# EAGLE design powersupppy (EAGLE 7.2.0)
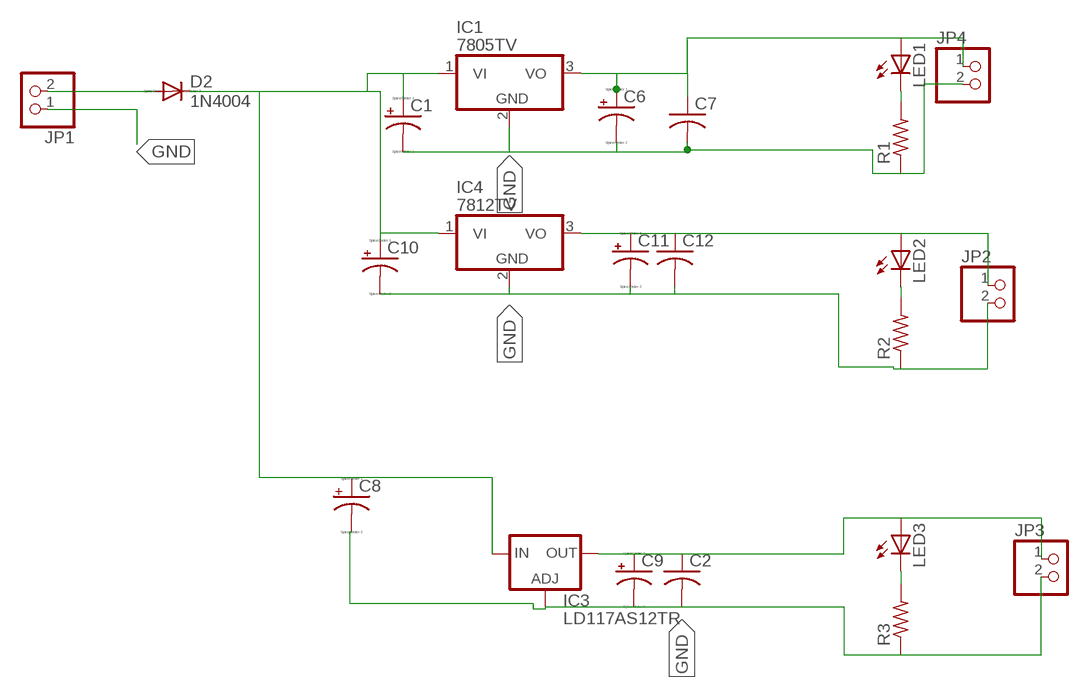
[diagram p0: schematic, sheet 1]

## Parts
C1  CPOL-USE2.5-5  [E2,5-5]
C2  C-US050-025X075  [C050-025X075]
C6  CPOL-USE2.5-5  [E2,5-5]
C7  C-US050-025X075  [C050-025X075]
C8  CPOL-USE2.5-5  [E2,5-5]
C9  CPOL-USE2.5-5  [E2,5-5]
C10  CPOL-USE2.5-5  [E2,5-5]
C11  CPOL-USE2.5-5  [E2,5-5]
C12  C-US050-025X075  [C050-025X075]
D2  1N4004  [DO41-10]
IC1  7805TV  [TO220V]
IC3  LD117AS12TR  [SOT223]
IC4  7812TV  [TO220V]
JP1  PINHD-1X2  [1X02]
JP2  PINHD-1X2  [1X02]
JP3  PINHD-1X2  [1X02]
JP4  PINHD-1X2  [1X02]
LED1  LED3MM  [LED3MM]
LED2  LED3MM  [LED3MM]
LED3  LED3MM  [LED3MM]
R1  R-US_0207/10  [0207/10]
R2  R-US_0207/10  [0207/10]
R3  R-US_R1206  [R1206]

## Nets
GND: C1.- C2.2 C6.- C7.2 C8.- C9.- C10.- C11.- C12.2 IC1.2(GND) IC3.1(ADJ) IC4.2(GND) JP1.1 JP2.2 JP3.2 JP4.2 R1.1 R2.1 R3.1
N$2: D2.A JP1.2
N$4: C1.+ C8.+ C10.+ D2.C IC1.1(VI) IC3.3(IN) IC4.1(VI)
N$6: C6.+ C7.1 IC1.3(VO) JP4.1 LED1.A
N$7: LED1.K(C) R1.2
N$10: C11.+ C12.1 IC4.3(VO) JP2.1 LED2.A
N$11: LED2.K(C) R2.2
N$13: C2.1 C9.+ IC3.4(OUT) JP3.1 LED3.A
N$14: LED3.K(C) R3.2

## Library data of the parts
C1 C6 C8-C11 = resistor:CPOL-US: POLARIZED CAPACITOR, American symbol
C2 C7 C12 = rcl:C-US: CAPACITOR, American symbol
D2 = diode:1N4004: DIODE general purpose rectifier, 1 A
IC1 IC4 = linear:78*: Positive VOLTAGE REGULATOR Source: http://cache.national.com/ds/LM/LM78L05.pdf http://www.fairchildsemi.com/ds/LM/LM7805.pdf
IC3 = v-reg:LD117A?*: Low drop fixed and adjustable positive voltage regulators 1 A Source: http://www.st.com/stonline/products/literature/ds/7194/ld1117axx.pdf
JP1-JP4 = pinhead:PINHD-1X2: PIN HEADER
LED1-LED3 = led:LED: LED OSRAM: - CHIPLED LG R971, LG N971, LY N971, LG Q971, LY Q971, LO R971, LY R971 LH N974, LH R974 LS Q976, LO Q976, LY Q976 LO Q996 - Hyper CHIPLED LW Q18S LB Q993, LB Q99A, LB R99A - SideLED LS A670, LO A670, LY A670, LG A670, LP A670 LB A673, LV A673, LT A673, LW A673 LH A674 LY A675 LS A676, LA A676, LO A676, LY A676, LW A676 LS A679, LY A679, LG A679 - Hyper Micro SIDELED® LS Y876, LA Y876, LO Y876, LY Y876 LT Y87S - SmartLED LW L88C, LW L88S LB L89C, LB L89S, LG L890 LS L89K, LO L89K, LY L89K LS L896, LA L896, LO L896, LY L896 - TOPLED LS T670, LO T670, LY T670, LG T670, LP T670 LSG T670, LSP T670, LSY T670, LOP T670, LYG T670 LG T671, LOG T671, LSG T671 LB T673, LV T673, LT T673, LW T673 LH T674 LS T676, LA T676, LO T676, LY T676, LB T676, LH T676, LSB T676, LW T676 LB T67C, LV T67C, LT T67C, LS T67K, LO T67K, LY T67K, LW E67C LS E67B, LA E67B, LO E67B, LY E67B, LB E67C, LV E67C, LT E67C LW T67C LS T679, LY T679, LG T679 LS T770, LO T770, LY T770, LG T770, LP T770 LB T773, LV T773, LT T773, LW T773 LH T774 LS E675, LA E675, LY E675, LS T675 LS T776, LA T776, LO T776, LY T776, LB T776 LHGB T686 LT T68C, LB T68C - Hyper Mini TOPLED® LB M676 - Mini TOPLED Santana® LG M470 LS M47K, LO M47K, LY M47K Source: http://www.osram.convergy.de LUXEON: - LUMILED® LXK2-PW12-R00, LXK2-PW12-S00, LXK2-PW14-U00, LXK2-PW14-V00 LXK2-PM12-R00, LXK2-PM12-S00, LXK2-PM14-U00 LXK2-PE12-Q00, LXK2-PE12-R00, LXK2-PE12-S00, LXK2-PE14-T00, LXK2-PE14-U00 LXK2-PB12-K00, LXK2-PB12-L00, LXK2-PB12-M00, LXK2-PB14-N00, LXK2-PB14-P00, LXK2-PB14-Q00 LXK2-PR12-L00, LXK2-PR12-M00, LXK2-PR14-Q00, LXK2-PR14-R00 LXK2-PD12-Q00, LXK2-PD12-R00, LXK2-PD12-S00 LXK2-PH12-R00, LXK2-PH12-S00 LXK2-PL12-P00, LXK2-PL12-Q00, LXK2-PL12-R00 Source: www.luxeon.com KINGBRIGHT: KA-3528ASYC Source: www.kingbright.com
R1-R3 = rcl:R-US_: RESISTOR, American symbol

## Board
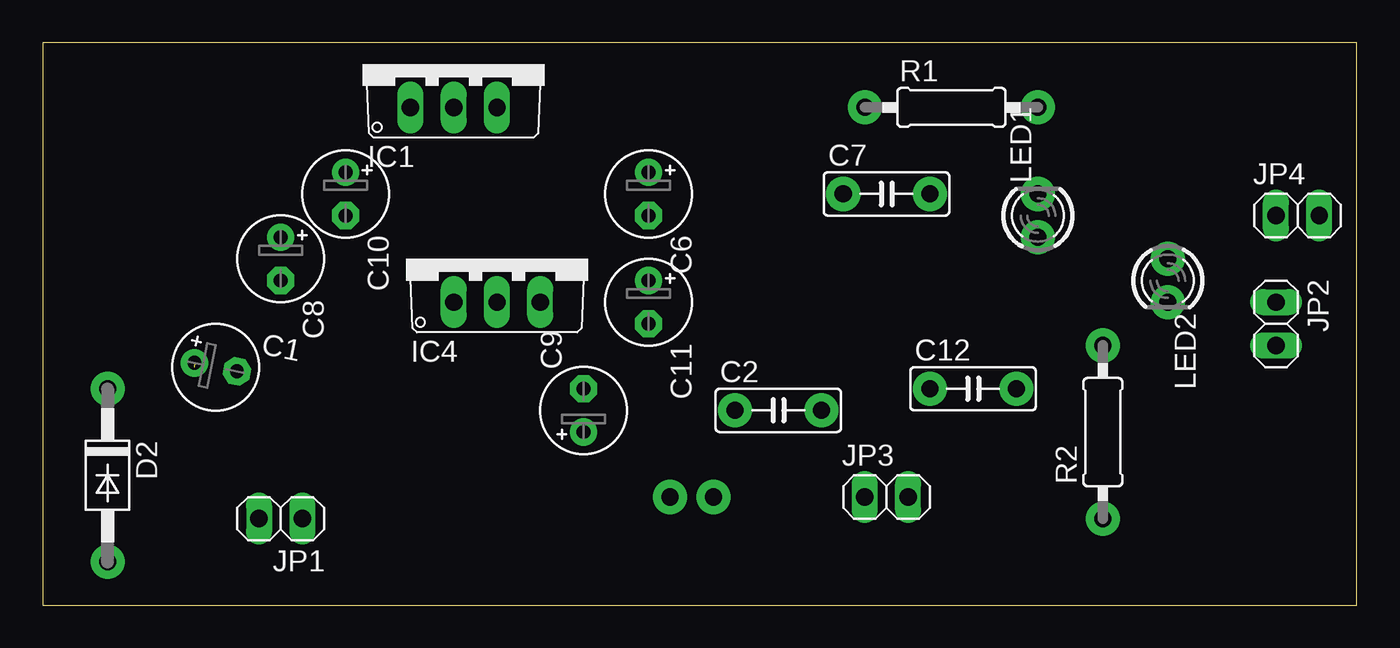
[diagram p1: board, top side]
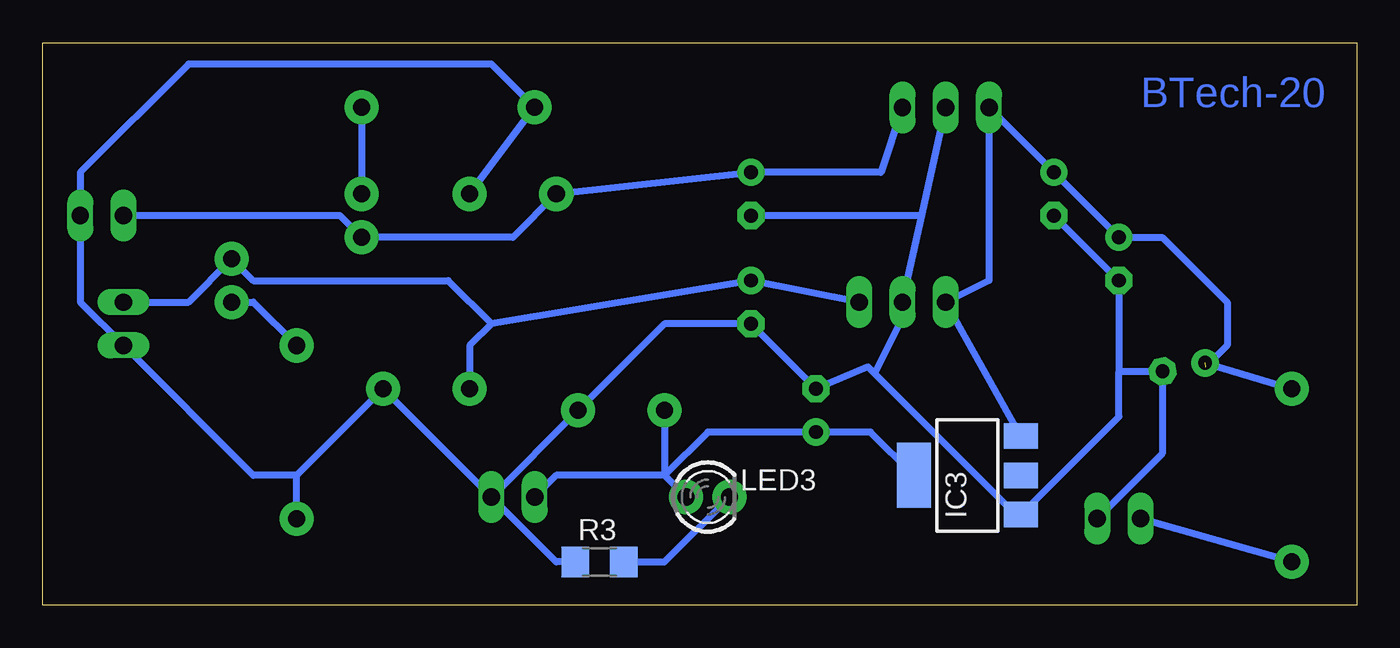
[diagram p2: board, bottom side, seen from below]

Size 77.14 x 33.01 mm. Coordinates in mm from the lower left corner, seen from the top.
Outline: 0,0 77.14,0 77.14,33.01 0,33.01 0,0
Copper layers (1*16): Top 0.035mm / dielectric 1.5mm / Bottom 0.035mm
Design rules "default *": minimum track width 10mil, minimum drill 24mil, track to track 16mil, track to pad 8mil, pad to pad 8mil, via to via 8mil, smd to smd 8mil, copper to edge 40mil, drill to drill 8mil, minimum pad ring 10mil, minimum via ring 8mil, stop-mask expansion 4mil, vias tented up to drill 0mil, thermal gap 10mil

### Footprints (pad centres in the part's own frame; a part is rotated, then mirrored left to right if it is on the bottom)
E2,5-5 = drill 0.813 pad 1.6: + -1.27,0 | drill 0.813 pad 1.6 octagon: - 1.27,0
C050-025X075 = drill 1 pad 2: 1 -2.54,0; 2 2.54,0
DO41-10 = drill 1 pad 2: A 5.08,0; C -5.08,0
TO220V = drill 1.016 long: 1 -2.54,-2.54; 2 0,-2.54; 3 2.54,-2.54
SOT223 = smd 1.5 x 2: 1 -2.3,-3.15; 2 0,-3.15; 3 2.3,-3.15 | smd 3.8 x 2: 4 0,3.15
1X02 = drill 1.016 long: 1 -1.27,0; 2 1.27,0
LED3MM = drill 1 pad 2: A -1.27,0; K 1.27,0
0207/10 = drill 1 pad 2: 1 -5.08,0; 2 5.08,0
R1206 = smd 1.6 x 1.803: 1 -1.422,0; 2 1.422,0

### Placement (x,y rotation side)
C1  10.16,13.97 348.7 top
C2  43.18,11.43 0 top
C6  35.56,24.13 270 top
C7  49.53,24.13 0 top
C8  13.97,20.32 270 top
C9  31.75,11.43 90 top
C10  17.78,24.13 270 top
C11  35.56,17.78 270 top
C12  54.61,12.7 0 top
D2  3.81,7.62 270 top
IC1  24.13,31.75 0 top
IC3  22.86,7.62 90 bottom
IC4  26.67,20.32 0 top
JP1  13.97,5.08 180 top
JP2  72.39,16.51 270 top
JP3  49.53,6.35 0 top
JP4  73.66,22.86 0 top
LED1  58.42,22.86 90 top
LED2  66.04,19.05 270 top
LED3  38.1,6.35 0 bottom
R1  53.34,29.21 0 top
R2  62.23,10.16 90 top
R3  44.45,2.54 0 bottom

### Tracks (layer width: path | path; a pad name or v marks a point on that pad's centre or on a via)
GND
  Bottom 0.406: R3.1 46.99,2.54 JP3.2 | R2.1 62.23,7.62 | 62.23,7.62 C12.2 JP3.2 | 62.23,7.62 64.77,7.62 JP2.2 74.93,17.78 JP4.2 74.93,25.4 68.58,31.75 50.8,31.75 R1.1 C7.2 | JP3.2 C2.2 40.64,16.51 C11.- C9.- 28.68,13.98 28.31,13.6 | C10.- C8.- 13.97,13.7 | 13.97,13.7 13.97,11.06 IC3.1 20.02,5.32 28.31,13.6 | 25.53,22.89 IC4.2 26.67,16.88 28.31,13.6 | 25.53,22.89 IC1.2 | C6.- 35.53,22.89 25.53,22.89 | 11.43,13.7 11.43,8.89 JP1.1 | C1.- 11.43,13.7 | 11.43,13.7 13.97,13.7
N$2
  Bottom 0.406: D2.A JP1.2
N$4  (1 unrouted)
  Bottom 0.406: C1.+ D2.C | IC3.3 IC4.1 21.59,19.05 IC1.1 C10.+ C8.+ 11.43,21.59 7.62,17.78 7.62,15.24 8.89,13.97
N$6
  Bottom 0.406: IC1.3 27.94,25.4 C6.+ C7.1 49.53,21.59 LED1.A 59.69,22.86 JP4.1
N$7
  Bottom 0.406: R1.2 LED1.K
N$10
  Bottom 0.406: JP2.1 68.58,17.78 LED2.A 64.77,19.05 53.34,19.05 50.8,16.51 | 50.8,16.51 52.07,15.24 C12.1 | IC4.3 C11.+ 50.8,16.51
N$11
  Bottom 0.406: LED2.K 64.77,17.78 R2.2
N$13
  Bottom 0.406: C2.1 40.64,7.62 | 40.64,7.62 LED3.A | 40.64,7.62 46.99,7.62 JP3.1 | 40.64,7.62 38.1,10.16 C9.+ 28.55,10.16 IC3.4
N$14
  Bottom 0.406: R3.2 40.64,2.54 LED3.K

### Text on the board
Bottom: BTech-20